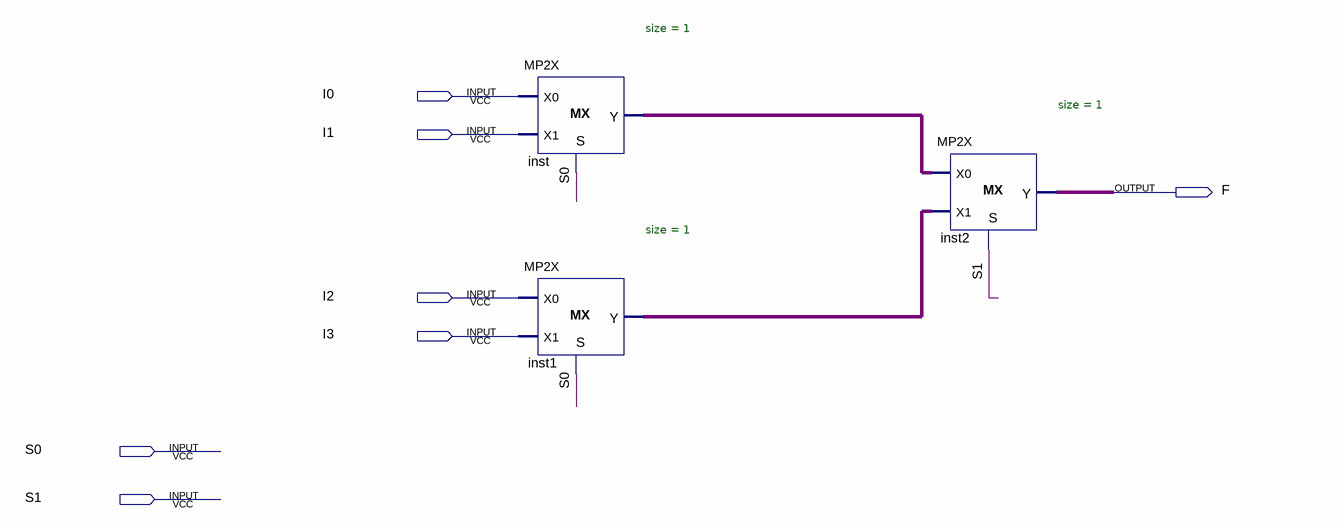
[diagram p0: schematic sheet]
// Quartus schematic MP1_4.bdf as structural Verilog: 3 symbols, 7 pins
module MP1_4 (
  input  I0,
  input  I1,
  input  I2,
  input  I3,
  input  S0,
  input  S1,
  output F
);

  wire inst1_y, inst_y;

  MP2X #(.size(1)) inst (.S(S0), .X0(I0), .X1(I1), .Y(inst_y));
  MP2X #(.size(1)) inst1 (.S(S0), .X0(I2), .X1(I3), .Y(inst1_y));
  MP2X #(.size(1)) inst2 (.S(S1), .X0(inst_y), .X1(inst1_y), .Y(F));
endmodule
